# EAGLE board automata (EAGLE 9.6.2), part 1 of 2
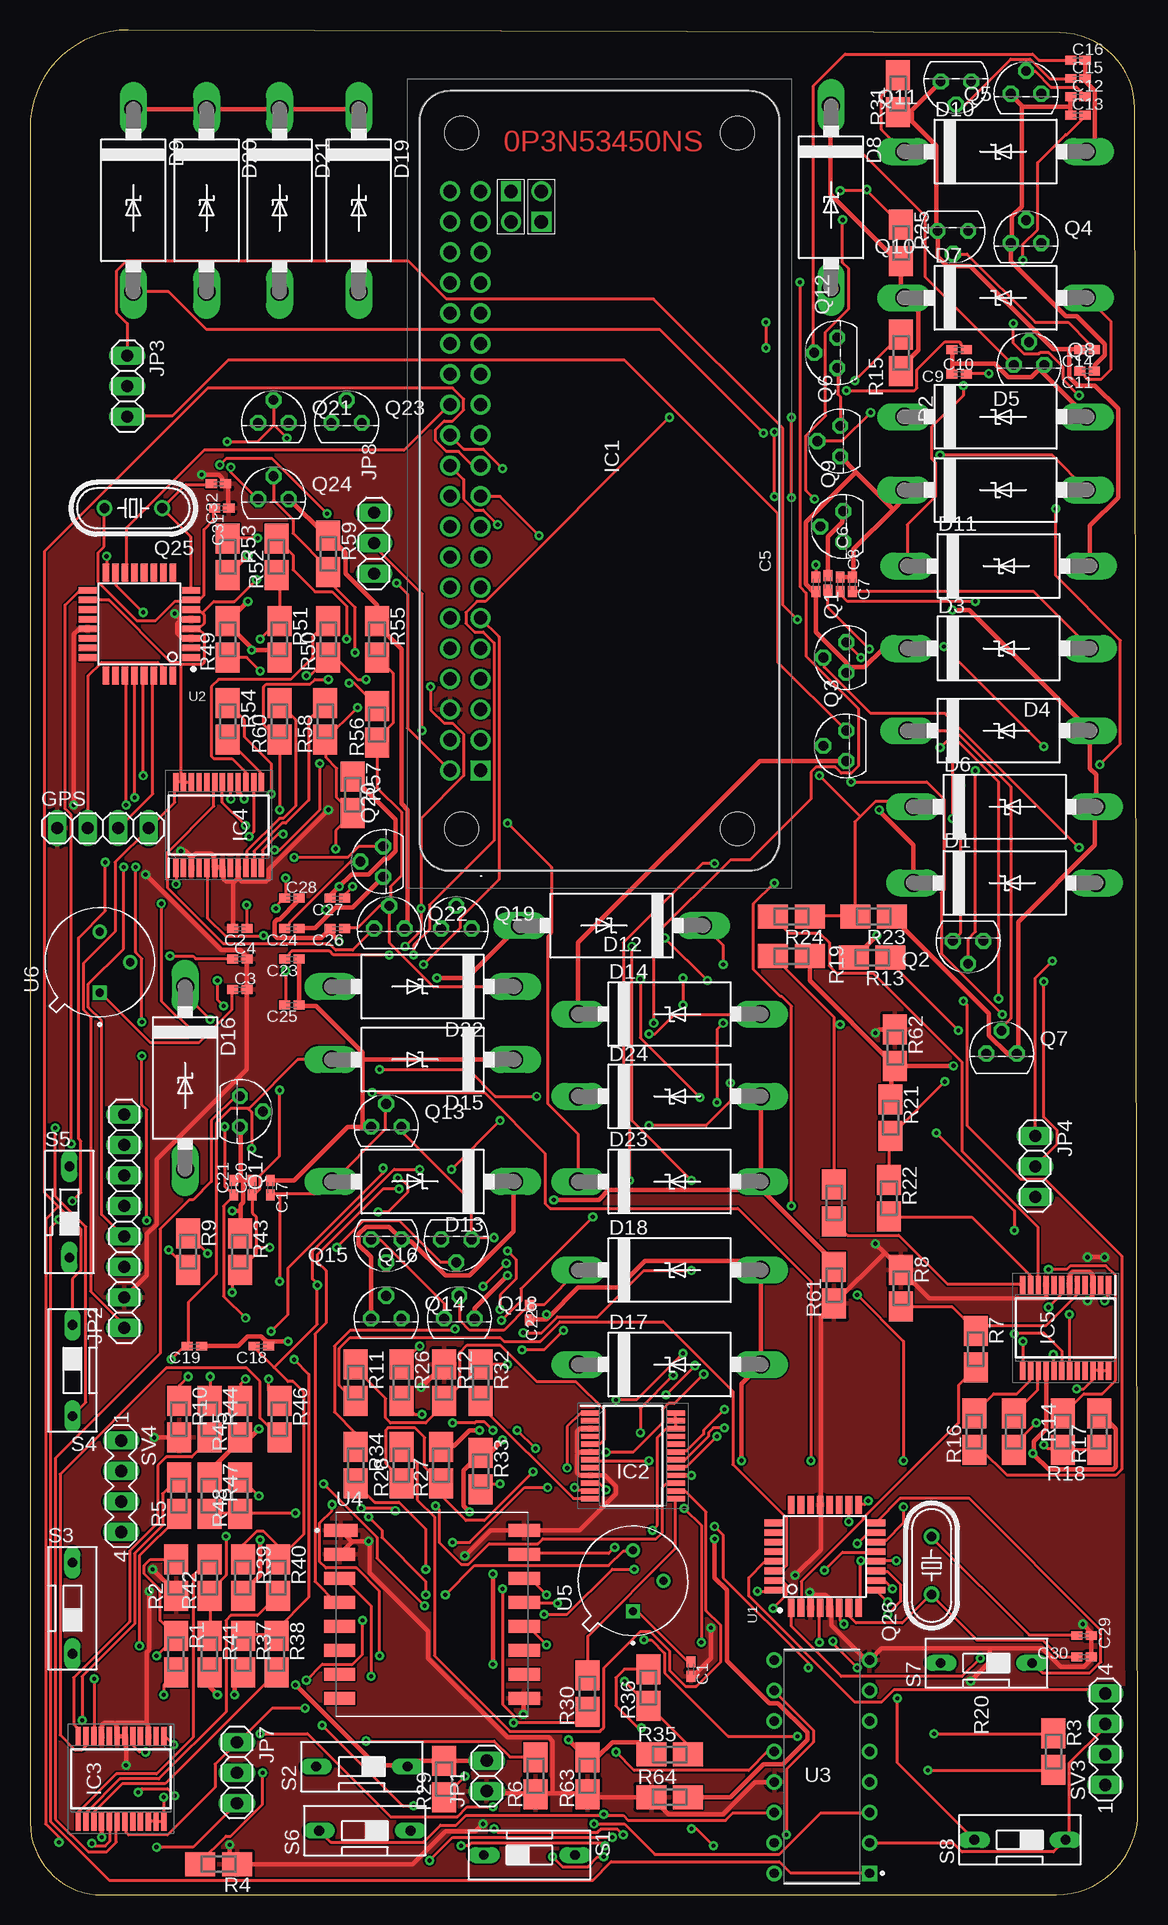
[diagram p2: board, top side]
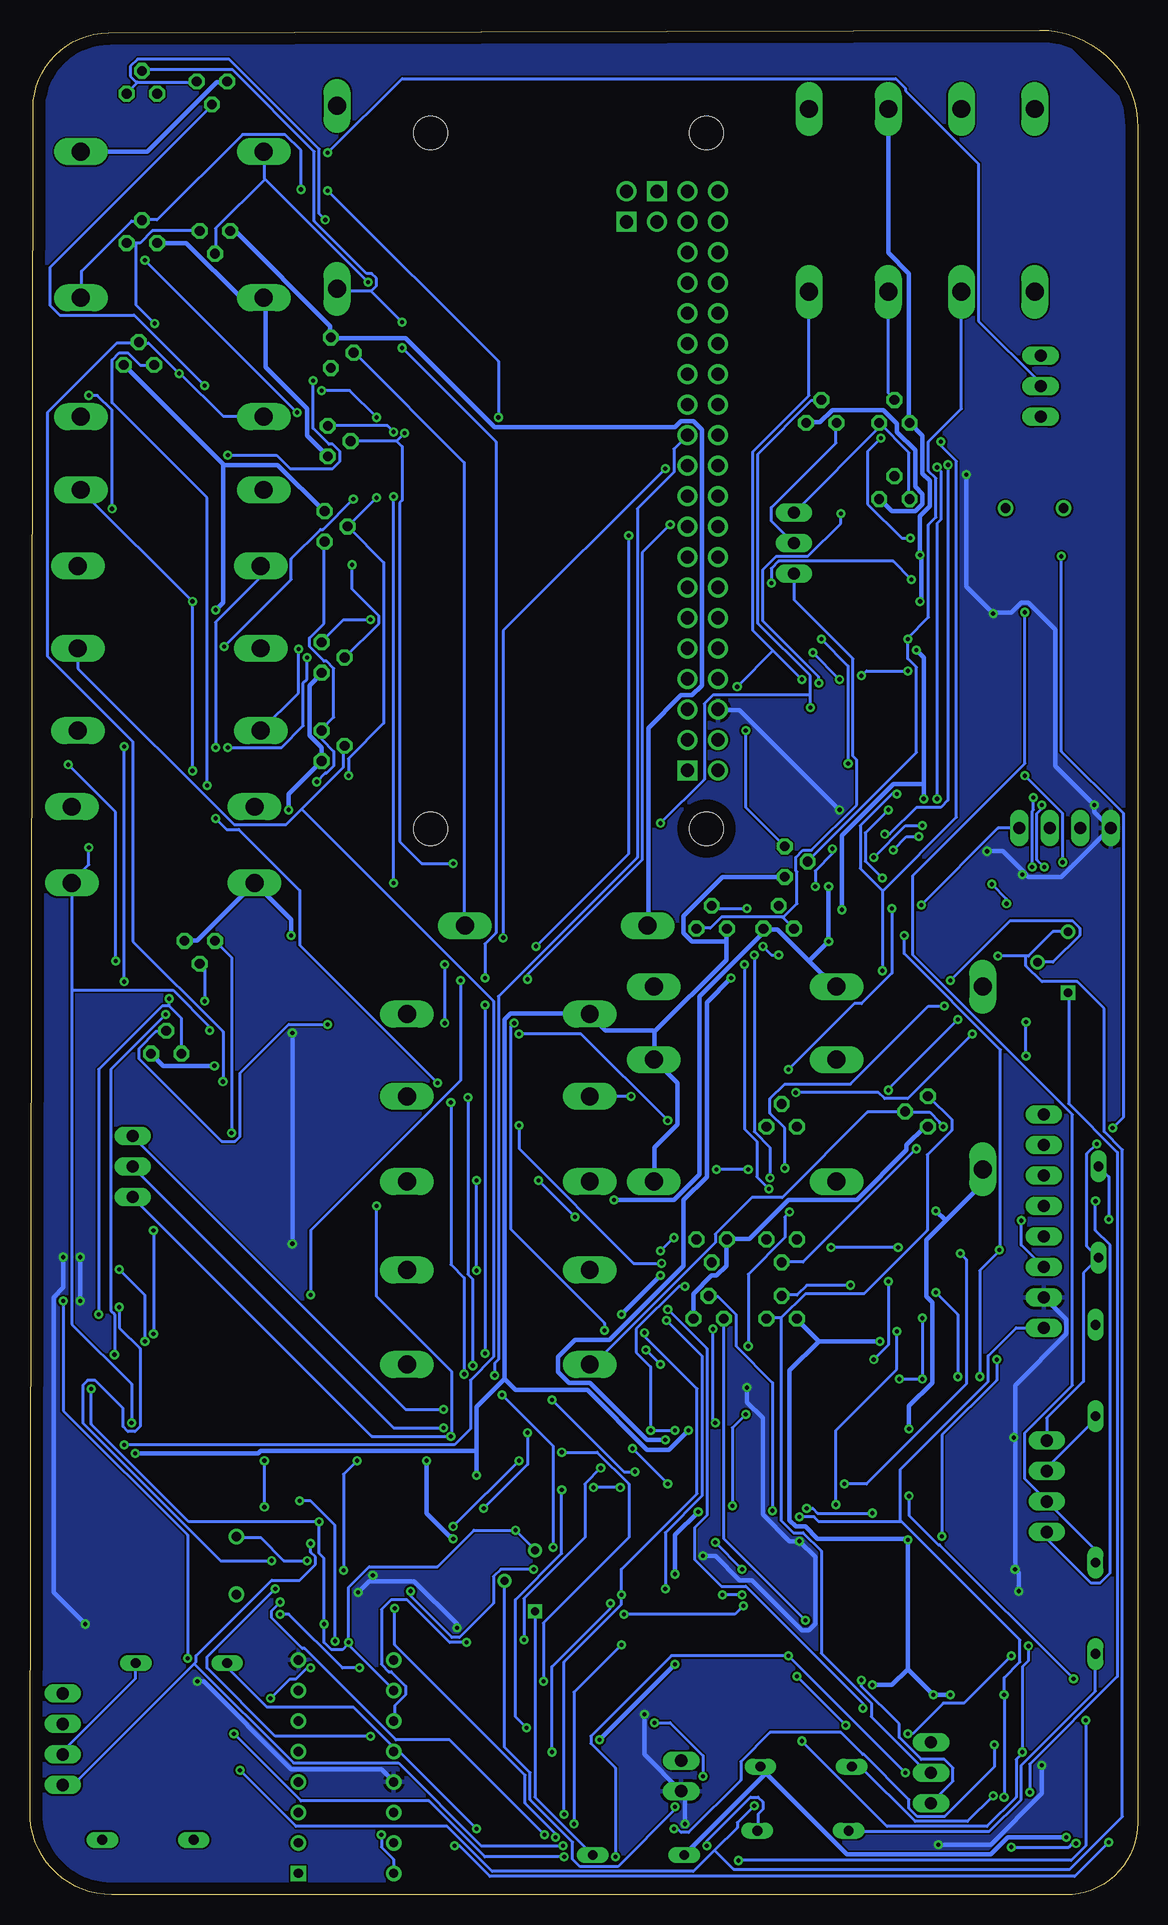
[diagram p3: board, bottom side, seen from below]

Size 92.37 x 155.45 mm. Coordinates in mm from the lower left corner, seen from the top.
Outline: 85.83,155.21 8.19,155.45 arc90 0,147.28 0.02,6.01 arc90 6.03,0 85.55,0.02 arc90 92.37,6.86 92.11,148.92 arc90 85.83,155.21
Copper layers (1*16): Top 0.035mm / dielectric 1.5mm / Bottom 0.035mm
Design rules "default *": minimum track width 6mil, minimum drill 0.35mm, track to track 6mil, track to pad 6mil, pad to pad 6mil, via to via 6mil, smd to smd 6mil, copper to edge 40mil, drill to drill 6mil, minimum pad ring 10mil, minimum via ring 8mil, stop-mask expansion 4mil, vias tented up to drill 0mil, thermal gap 10mil
Net classes: 0 default: width 0.254 mm, drill 0.254 mm, clearance 0.127 mm; 1 12v: width 0.381 mm, drill 0.254 mm, clearance 0.127 mm

## Footprints (pad centres in the part's own frame; a part is rotated, then mirrored left to right if it is on the bottom)
C0402K = smd 0.925 x 0.74: 1 -0.6,0; 2 0.6,0
C4111-15 = drill 1.499 long: A 7.62,0; C -7.62,0
1X04 = drill 1.016 long: 1 -3.81,0; 2 -1.27,0; 3 1.27,0; 4 3.81,0
RASPBERRYPIZEROWV13 = drill 1.11 pad 1.665 square: 1 -23.885,9.92; 41 24.375,7.38; 43 21.835,4.84 | drill 1.11 pad 1.665: 2 -23.885,12.46; 3 -21.345,9.92; 4 -21.345,12.46; 5 -18.805,9.92; 6 -18.805,12.46; 7 -16.265,9.92; 8 -16.265,12.46; 9 -13.725,9.92; 10 -13.725,12.46; 11 -11.185,9.92; 12 -11.185,12.46; 13 -8.645,9.92; 14 -8.645,12.46; 15 -6.105,9.92; 16 -6.105,12.46; 17 -3.565,9.92; 18 -3.565,12.46; 19 -1.025,9.92; 20 -1.025,12.46; 21 1.515,9.92; 22 1.515,12.46; 23 4.055,9.92; 24 4.055,12.46; 25 6.595,9.92; 26 6.595,12.46; 27 9.135,9.92; 28 9.135,12.46; 29 11.675,9.92; 30 11.675,12.46; 31 14.215,9.92; 32 14.215,12.46; 33 16.755,9.92; 34 16.755,12.46; 35 19.295,9.92; 36 19.295,12.46; 37 21.835,9.92; 38 21.835,12.46; 39 24.375,9.92; 40 24.375,12.46; 42 21.835,7.38; 44 24.375,4.84 | hole 2.8: -28.755,11.5; -28.755,-11.5; 29.245,-11.5; 29.245,11.5
SOP65P760X160-24N = smd 1.525 x 0.45: 1 -3.562,3.575; 2 -3.562,2.925; 3 -3.562,2.275; 4 -3.562,1.625; 5 -3.562,0.975; 6 -3.562,0.325; 7 -3.562,-0.325; 8 -3.562,-0.975; 9 -3.562,-1.625; 10 -3.562,-2.275; 11 -3.562,-2.925; 12 -3.562,-3.575; 13 3.562,-3.575; 14 3.562,-2.925; 15 3.562,-2.275; 16 3.562,-1.625; 17 3.562,-0.975; 18 3.562,-0.325; 19 3.562,0.325; 20 3.562,0.975; 21 3.562,1.625; 22 3.562,2.275; 23 3.562,2.925; 24 3.562,3.575
1X02 = drill 1.016 long: 1 -1.27,0; 2 1.27,0
1X08 = drill 1.016 long: 1 -8.89,0; 2 -6.35,0; 3 -3.81,0; 4 -1.27,0; 5 1.27,0; 6 3.81,0; 7 6.35,0; 8 8.89,0
1X03 = drill 1.016 long: 1 -2.54,0; 2 0,0; 3 2.54,0
TO92 = drill 0.813 octagon: 1 1.27,0; 2 0,1.905; 3 -1.27,0
HC49/S = drill 0.813: 1 -2.413,0; 2 2.413,0
SMK = smd 2.5 x 2: 1 1.524,0; 2 -1.524,0
DS-01 = drill 0.813 long: 1 0,-3.81; 2 0,3.81
MA04-1 = drill 1.016 long: 1 -3.81,0; 2 -1.27,0; 3 1.27,0; 4 3.81,0
QFP80P900X900X120-32N = smd 1.5 x 0.55: 1 -4.3,2.8; 2 -4.3,2; 3 -4.3,1.2; 4 -4.3,0.4; 5 -4.3,-0.4; 6 -4.3,-1.2; 7 -4.3,-2; 8 -4.3,-2.8; 17 4.3,-2.8; 18 4.3,-2; 19 4.3,-1.2; 20 4.3,-0.4; 21 4.3,0.4; 22 4.3,1.2; 23 4.3,2; 24 4.3,2.8 | smd 0.55 x 1.5: 9 -2.8,-4.3; 10 -2,-4.3; 11 -1.2,-4.3; 12 -0.4,-4.3; 13 0.4,-4.3; 14 1.2,-4.3; 15 2,-4.3; 16 2.8,-4.3; 25 2.8,4.3; 26 2,4.3; 27 1.2,4.3; 28 0.4,4.3; 29 -0.4,4.3; 30 -1.2,4.3; 31 -2,4.3; 32 -2.8,4.3
DIP794W45P254L1969H508Q16 = drill 0.78 pad 1.13 square: 1 -3.97,8.89 | drill 0.78 pad 1.13: 2 -3.97,6.35; 3 -3.97,3.81; 4 -3.97,1.27; 5 -3.97,-1.27; 6 -3.97,-3.81; 7 -3.97,-6.35; 8 -3.97,-8.89; 9 3.97,-8.89; 10 3.97,-6.35; 11 3.97,-3.81; 12 3.97,-1.27; 13 3.97,1.27; 14 3.97,3.81; 15 3.97,6.35; 16 3.97,8.89
MODULE_RA-02_LORA = smd 2.8 x 1.1: 1 -7.6,7 | smd 2.6 x 1.1: 2 -7.7,5; 3 -7.7,3; 4 -7.7,1; 5 -7.7,-1; 6 -7.7,-3; 7 -7.7,-5; 8 -7.7,-7; 9 7.7,-7; 10 7.7,-5; 11 7.7,-3; 12 7.7,-1; 13 7.7,1; 14 7.7,3; 15 7.7,5; 16 7.7,7
TO254P914H670-3 = drill 0.68 pad 1.08 square: 1 -2.54,0 | drill 0.68 pad 1.08: 2 0,-2.54; 3 2.54,0

## Placement (x,y rotation side)
C1  100uf  [C0402K]  55.1,18.82 270 top
C2  10uf  [C0402K]  17.51,80.54 180 top
C3  100uf  [C0402K]  17.51,75.46 0 top
C4  10uf  [C0402K]  17.51,78 0 top
C5  100uf  [C0402K]  65.51,109.24 90 top
C6  100uf  [C0402K]  67.54,109.24 270 top
C7  100uf  [C0402K]  68.56,109.24 270 top
C8  100uf  [C0402K]  66.53,109.37 90 top
C9  100uf  [C0402K]  77.45,126.77 180 top
C10  100uf  [C0402K]  77.45,128.8 180 top
C11  100uf  [C0402K]  88.12,127.02 180 top
C12  100uf  [C0402K]  87.36,149.88 0 top
C13  100uf  [C0402K]  87.36,148.36 0 top
C14  100uf  [C0402K]  88.12,128.8 180 top
C15  100uf  [C0402K]  87.36,151.41 0 top
C16  100uf  [C0402K]  87.36,152.93 0 top
C17  100uf  [C0402K]  20.05,58.95 270 top
C18  100uf  [C0402K]  19.28,45.74 180 top
C19  100uf  [C0402K]  13.7,45.74 180 top
C20  100uf  [C0402K]  18.52,58.95 90 top
C21  100uf  [C0402K]  17,58.95 90 top
C22  100uf  [C0402K]  41.64,48.54 270 top
C23  100uf  [C0402K]  21.82,78 180 top
C24  100uf  [C0402K]  21.82,80.54 180 top
C25  100uf  [C0402K]  21.82,74.19 180 top
C26  100uf  [C0402K]  25.63,80.54 180 top
C27  100uf  [C0402K]  25.63,83.08 180 top
C28  100uf  [C0402K]  21.82,83.08 0 top
C29  22pf  [C0402K]  87.86,19.83 180 top
C30  22pf  [C0402K]  87.86,21.61 180 top
C31  22pf  [C0402K]  15.98,115.59 180 top
C32  22pf  [C0402K]  15.73,117.62 180 top
D1  1N5908  [C4111-15]  81.26,84.35 0 top
D2  1N5908  [C4111-15]  80.5,117.12 0 top
D3  1N5908  [C4111-15]  80.75,103.91 0 top
D4  1N5908  [C4111-15]  80.75,97.05 0 top
D5  1N5908  [C4111-15]  80.5,123.21 0 top
D6  1N5908  [C4111-15]  81.26,90.7 0 top
D7  1N5908  [C4111-15]  80.5,133.12 0 top
D8  1N5908  [C4111-15]  66.78,141.5 270 top
D9  1N5908  [C4111-15]  8.62,141.25 270 top
D10  1N5908  [C4111-15]  80.5,145.31 0 top
D11  1N5908  [C4111-15]  80.75,110.77 0 top
D12  1N5908  [C4111-15]  48.49,80.79 180 top
D13  1N5908  [C4111-15]  32.75,59.46 180 top
D14  1N5908  [C4111-15]  53.32,73.43 0 top
D15  1N5908  [C4111-15]  32.75,69.62 180 top
D16  1N5908  [C4111-15]  12.93,68.09 270 top
D17  1N5908  [C4111-15]  53.32,44.22 0 top
D18  1N5908  [C4111-15]  53.32,52.09 0 top
D19  1N5908  [C4111-15]  27.41,141.25 270 top
D20  1N5908  [C4111-15]  14.71,141.25 270 top
D21  1N5908  [C4111-15]  20.81,141.25 270 top
D22  1N5908  [C4111-15]  32.75,75.71 180 top
D23  1N5908  [C4111-15]  53.32,59.46 0 top
D24  1N5908  [C4111-15]  53.32,66.57 0 top
GPS  [1X04]  6.08,88.92 0 top
IC1  RASPBERRY_PI_ZERO_W__V1.3_  [RASPBERRYPIZEROWV13]  47.48,117.62 90 top
IC2  TB9061AFNG,EL  [SOP65P760X160-24N]  50.27,36.6 0 top
IC3  TB9061AFNG,EL  [SOP65P760X160-24N]  7.6,9.67 270 top
IC4  TB9061AFNG,EL  [SOP65P760X160-24N]  15.73,89.18 90 top
IC5  TB9061AFNG,EL  [SOP65P760X160-24N]  86.34,47.27 270 top
JP1  12v  [1X02]  38.08,9.93 90 top
JP2  IMU  [1X08]  7.85,56.16 90 top
JP3  A`  [1X03]  8.11,125.75 270 top
JP4  B  [1X03]  83.8,60.73 270 top
JP7  B`  [1X03]  17.25,10.18 270 top
JP8  A  [1X03]  28.68,112.67 90 top
Q1  BSS110  [TO92]  68.05,103.15 90 top
Q2  BSS110  [TO92]  78.21,79.52 180 top
Q3  BSS110  [TO92]  68.05,95.78 90 top
Q4  BSS110  [TO92]  83.04,137.69 0 top
Q5  BSS110  [TO92]  83.04,150.14 0 top
Q6  BSS110  [TO92]  67.54,121.18 90 top
Q7  BSS101  [TO92]  81.01,70.13 0 top
Q8  BSS101  [TO92]  83.29,127.53 0 top
Q9  BSS101  [TO92]  67.8,114.07 90 top
Q10  BSS101  [TO92]  76.94,138.71 180 top
Q11  BSS101  [TO92]  77.2,151.15 180 top
Q12  BSS101  [TO92]  67.29,128.55 90 top
Q13  BSS110  [TO92]  29.7,64.03 0 top
Q14  BSS110  [TO92]  29.7,48.03 0 top
Q15  BSS110  [TO92]  29.7,54.63 180 top
Q16  BSS101  [TO92]  35.54,54.63 180 top
Q17  BSS101  [TO92]  17.51,65.3 270 top
Q18  BSS101  [TO92]  35.79,48.03 0 top
Q19  BSS110  [TO92]  35.54,80.54 0 top
Q20  BSS110  [TO92]  29.44,86.13 90 top
Q21  BSS110  [TO92]  20.3,122.7 0 top
Q22  BSS101  [TO92]  29.95,80.54 0 top
Q23  BSS101  [TO92]  26.4,122.7 0 top
Q24  BSS101  [TO92]  20.3,116.35 0 top
Q25  16Mhz  [HC49/S]  8.62,115.59 180 top
Q26  16Mhz  [HC49/S]  75.16,27.45 90 top
R1  220ohms  [SMK]  12.17,20.09 270 top
R2  580ohms  [SMK]  12.17,26.44 90 top
R3  330ohms  [SMK]  85.32,11.96 270 top
R4  560ohms  [SMK]  15.73,2.56 180 top
R5  10K  [SMK]  12.43,33.3 90 top
R6  20K  [SMK]  42.14,9.93 90 top
R7  10K  [SMK]  78.85,45.49 270 top
R8  20K  [SMK]  72.62,50.57 270 top
R9  10K  [SMK]  13.19,53.62 270 top
R10  20K  [SMK]  12.43,39.65 270 top
R11  10K  [SMK]  27.16,42.69 270 top
R12  20K  [SMK]  34.52,42.69 270 top
R13  10K  [SMK]  70.21,78.13 180 top
R14  100ohms  [SMK]  82.02,38.63 90 top
R15  10K  [SMK]  72.62,128.55 270 top
R16  100ohms  [SMK]  78.72,38.63 90 top
R17  10K  [SMK]  89.13,38.63 90 top
R18  100ohms  [SMK]  86.09,38.63 90 top
R19  10K  [SMK]  63.48,78.25 180 top
R20  100ohms  [SMK]  67.04,57.68 270 top
R21  10K  [SMK]  71.73,64.79 270 top
R22  100ohms  [SMK]  71.61,58.06 270 top
R23  10K  [SMK]  70.34,81.56 180 top
R24  100ohms  [SMK]  63.48,81.56 180 top
R25  10K  [SMK]  72.62,137.69 270 top
R26  100ohms  [SMK]  30.97,42.69 270 top
R27  10K  [SMK]  34.27,35.84 90 top
R28  100ohms  [SMK]  30.97,35.84 90 top
R29  10K  [SMK]  34.52,9.67 90 top
R30  100ohms  [SMK]  46.46,16.79 90 top
R31  10K  [SMK]  72.37,150.14 90 top
R32  100ohms  [SMK]  37.57,42.69 270 top
R33  10K  [SMK]  37.57,35.33 270 top
R34  100ohms  [SMK]  27.16,35.84 270 top
R35  10K  [SMK]  53.32,11.71 0 top
R36  100ohms  [SMK]  51.54,17.29 90 top
R37  10K  [SMK]  17.76,20.09 270 top
R38  100ohms  [SMK]  20.55,20.09 270 top
R39  10K  [SMK]  17.76,26.44 270 top
R40  100ohms  [SMK]  20.68,26.44 270 top
R41  10K  [SMK]  14.97,20.09 270 top
R42  100ohms  [SMK]  14.97,26.44 90 top
R43  10K  [SMK]  17.51,53.62 270 top
R44  100ohms  [SMK]  14.97,39.65 270 top
R45  10K  [SMK]  17.51,39.65 90 top
R46  100ohms  [SMK]  20.81,39.65 270 top
R47  10K  [SMK]  14.97,33.3 270 top
R48  100ohms  [SMK]  17.51,33.3 90 top
R49  10K  [SMK]  16.49,104.67 90 top
R50  100ohms  [SMK]  24.87,104.67 90 top
R51  10K  [SMK]  20.81,104.67 270 top
R52  100ohms  [SMK]  20.55,111.53 90 top
R53  10K  [SMK]  16.49,111.53 270 top
R54  100ohms  [SMK]  16.49,97.81 270 top
R55  10K  [SMK]  28.94,104.67 270 top
R56  100ohms  [SMK]  28.94,97.56 90 top
R57  10K  [SMK]  26.9,91.72 270 top
R58  100ohms  [SMK]  24.62,97.81 90 top
R59  10K  [SMK]  24.87,111.78 270 top
R60  100ohms  [SMK]  20.81,97.81 90 top
R61  10K  [SMK]  67.04,50.82 90 top
R62  10K  [SMK]  72.12,70.63 270 top
R63  10K  [SMK]  46.46,9.93 90 top
R64  10K  [SMK]  53.32,8.15 0 top
S1  12v  [DS-01]  41.64,3.32 270 top
S2  12v  [DS-01]  27.67,10.69 90 top
S3  12v  [DS-01]  3.54,23.9 0 top
S4  12v  [DS-01]  3.54,43.71 180 top
S5  12v  [DS-01]  3.28,56.92 0 top
S6  12v  [DS-01]  27.92,5.36 90 top
S7  12v  [DS-01]  79.74,19.33 90 top
S8  12v  [DS-01]  82.53,4.59 90 top
SV3  SPI  [MA04-1]  89.64,12.98 90 top
SV4  SPI 2  [MA04-1]  7.6,34.06 270 top
U1  ATMEGA328P-AU  [QFP80P900X900X120-32N]  66.27,28.22 90 top
U2  ATMEGA328P-AU  [QFP80P900X900X120-32N]  9.12,105.94 180 top
U3  SN74HC595NDIP-16  [DIP794W45P254L1969H508Q16]  66.02,10.69 180 top
U4  RA-02_LORA  [MODULE_RA-02_LORA]  33.51,23.39 0 top
U5  LM117H/NOPB  [TO254P914H670-3]  50.27,26.18 90 top
U6  LM117H/NOPB  [TO254P914H670-3]  5.82,77.75 90 top